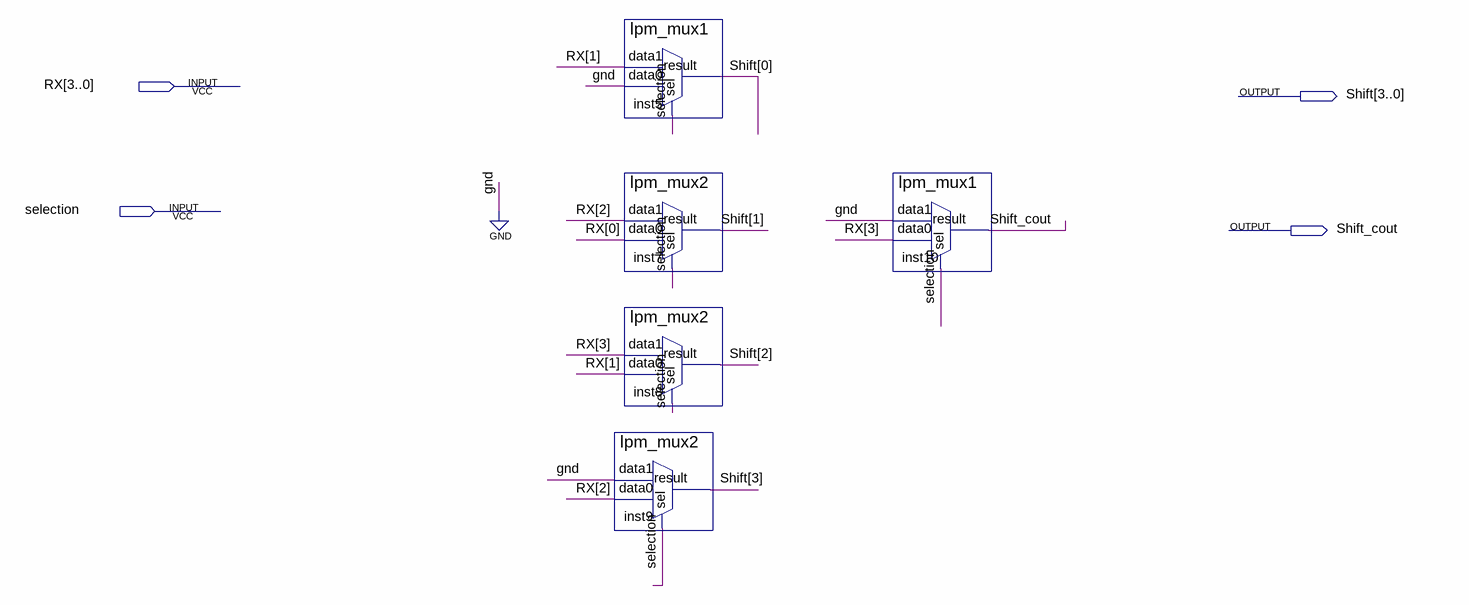
[diagram p0: schematic sheet]
// Quartus schematic Shift.bdf as structural Verilog: 5 symbols, 4 pins
module Shift (
  input  [3:0] RX,
  input  selection,
  output [3:0] Shift,
  output Shift_cout
);

  lpm_mux2 inst9 (.data1(1'b0), .data0(RX[2]), .sel(selection), .result(Shift[3]));
  lpm_mux1 inst5 (.data1(RX[1]), .data0(1'b0), .sel(selection), .result(Shift[0]));
  lpm_mux2 inst7 (.data1(RX[2]), .data0(RX[0]), .sel(selection), .result(Shift[1]));
  lpm_mux2 inst8 (.data1(RX[3]), .data0(RX[1]), .sel(selection), .result(Shift[2]));
  lpm_mux1 inst10 (.data1(1'b0), .data0(RX[3]), .sel(selection), .result(Shift_cout));
endmodule
